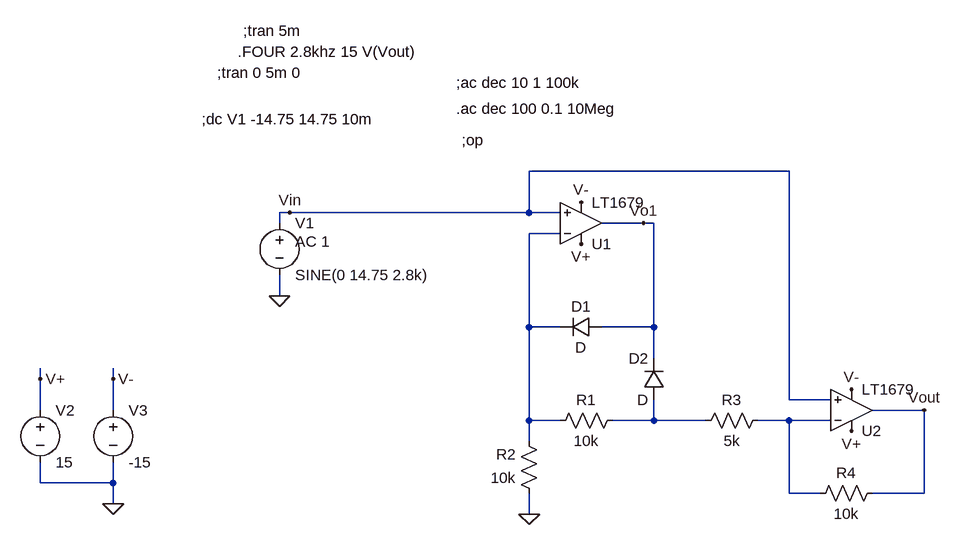
[diagram p0: schematic etaj4.asc]
etaj4.asc, the LTspice schematic file:
Version 4
SHEET 1 956 680
WIRE 320 -368 -80 -368
WIRE -448 -304 -464 -304
WIRE -80 -304 -80 -368
WIRE -80 -304 -448 -304
WIRE -32 -304 -80 -304
WIRE -464 -288 -464 -304
WIRE 96 -288 32 -288
WIRE 112 -288 96 -288
WIRE -32 -272 -80 -272
WIRE -464 -176 -464 -208
WIRE -80 -128 -80 -272
WIRE -32 -128 -80 -128
WIRE 112 -128 112 -288
WIRE 112 -128 32 -128
WIRE 112 -80 112 -128
WIRE -832 -48 -832 -64
WIRE -720 -48 -720 -64
WIRE 320 -16 320 -368
WIRE 384 -16 320 -16
WIRE -832 0 -832 -48
WIRE -720 0 -720 -48
WIRE 528 0 448 0
WIRE -80 16 -80 -128
WIRE -32 16 -80 16
WIRE 112 16 112 -16
WIRE 112 16 48 16
WIRE 192 16 112 16
WIRE 320 16 272 16
WIRE 384 16 320 16
WIRE -80 48 -80 16
WIRE -832 112 -832 80
WIRE -720 112 -720 80
WIRE -720 112 -832 112
WIRE 320 128 320 16
WIRE 368 128 320 128
WIRE 528 128 528 0
WIRE 528 128 448 128
WIRE -720 144 -720 112
WIRE -80 160 -80 128
FLAG -464 -176 0
FLAG -720 144 0
FLAG -832 -48 V+
FLAG -720 -48 V-
FLAG -448 -304 Vin
FLAG -80 160 0
FLAG 0 -320 V-
FLAG 0 -256 V+
FLAG 416 -32 V-
FLAG 416 32 V+
FLAG 528 0 Vout
FLAG 96 -288 Vo1
SYMBOL voltage -832 -16 R0
WINDOW 123 0 0 Left 2
WINDOW 39 0 0 Left 2
SYMATTR InstName V2
SYMATTR Value 15
SYMBOL voltage -720 -16 R0
WINDOW 123 0 0 Left 2
WINDOW 39 0 0 Left 2
SYMATTR InstName V3
SYMATTR Value -15
SYMBOL diode 32 -144 R90
WINDOW 0 0 32 VBottom 2
WINDOW 3 32 32 VTop 2
SYMATTR InstName D1
SYMBOL diode 128 -16 R180
WINDOW 0 24 64 Left 2
WINDOW 3 24 0 Left 2
SYMATTR InstName D2
SYMBOL res 64 0 R90
WINDOW 0 0 56 VBottom 2
WINDOW 3 32 56 VTop 2
SYMATTR InstName R1
SYMATTR Value 10k
SYMBOL res -64 144 R180
WINDOW 0 36 76 Left 2
WINDOW 3 36 40 Left 2
SYMATTR InstName R2
SYMATTR Value 10k
SYMBOL res 288 0 R90
WINDOW 0 0 56 VBottom 2
WINDOW 3 32 56 VTop 2
SYMATTR InstName R3
SYMATTR Value 5k
SYMBOL res 464 112 R90
WINDOW 0 0 56 VBottom 2
WINDOW 3 32 56 VTop 2
SYMATTR InstName R4
SYMATTR Value 10k
SYMBOL OpAmps\\LT1679 0 -288 M180
SYMATTR InstName U1
SYMBOL OpAmps\\LT1679 416 0 M180
SYMATTR InstName U2
SYMBOL voltage -464 -304 R0
WINDOW 123 24 44 Left 2
WINDOW 39 0 0 Left 0
SYMATTR Value2 AC 1
SYMATTR InstName V1
SYMATTR Value SINE(0 14.75 2.8k)
TEXT -560 -520 Left 2 !;tran 0 5m 0
TEXT -584 -448 Left 2 !;dc V1 -14.75 14.75 10m
TEXT -192 -464 Left 2 !.ac dec 100 0.1 10Meg
TEXT -520 -584 Left 2 !;tran 5m
TEXT -528 -552 Left 2 !.FOUR 2.8khz 15 V(Vout)
TEXT -184 -416 Left 2 !;op
TEXT -192 -504 Left 2 !;ac dec 10 1 100k

The netlist it stands for:
* etaj4.asc
V2 V+ 0 15
V3 V- 0 -15
D1 Vo1 N001 D
D2 N002 Vo1 D
R1 N002 N001 10k
R2 0 N001 10k
R3 N003 N002 5k
R4 Vout N003 10k
* U1: LT1679 (symbol OpAmps\LT1679 not available, pins judged from their places): In+=Vin In-=N001 V+=V+ V-=V- OUT=Vo1
* U2: LT1679 (symbol OpAmps\LT1679 not available, pins judged from their places): In+=Vin In-=N003 V+=V+ V-=V- OUT=Vout
V1 Vin 0 SINE(0 14.75 2.8k) AC 1
.model D D
.lib standard.dio
;tran 0 5m 0
;dc V1 -14.75 14.75 10m
.ac dec 100 0.1 10Meg
;tran 5m
.FOUR 2.8khz 15 V(Vout)
;op
;ac dec 10 1 100k
.backanno
.end